# Altium schematic sheet PowerBreakout.SchDoc
size 482 x 266 mm
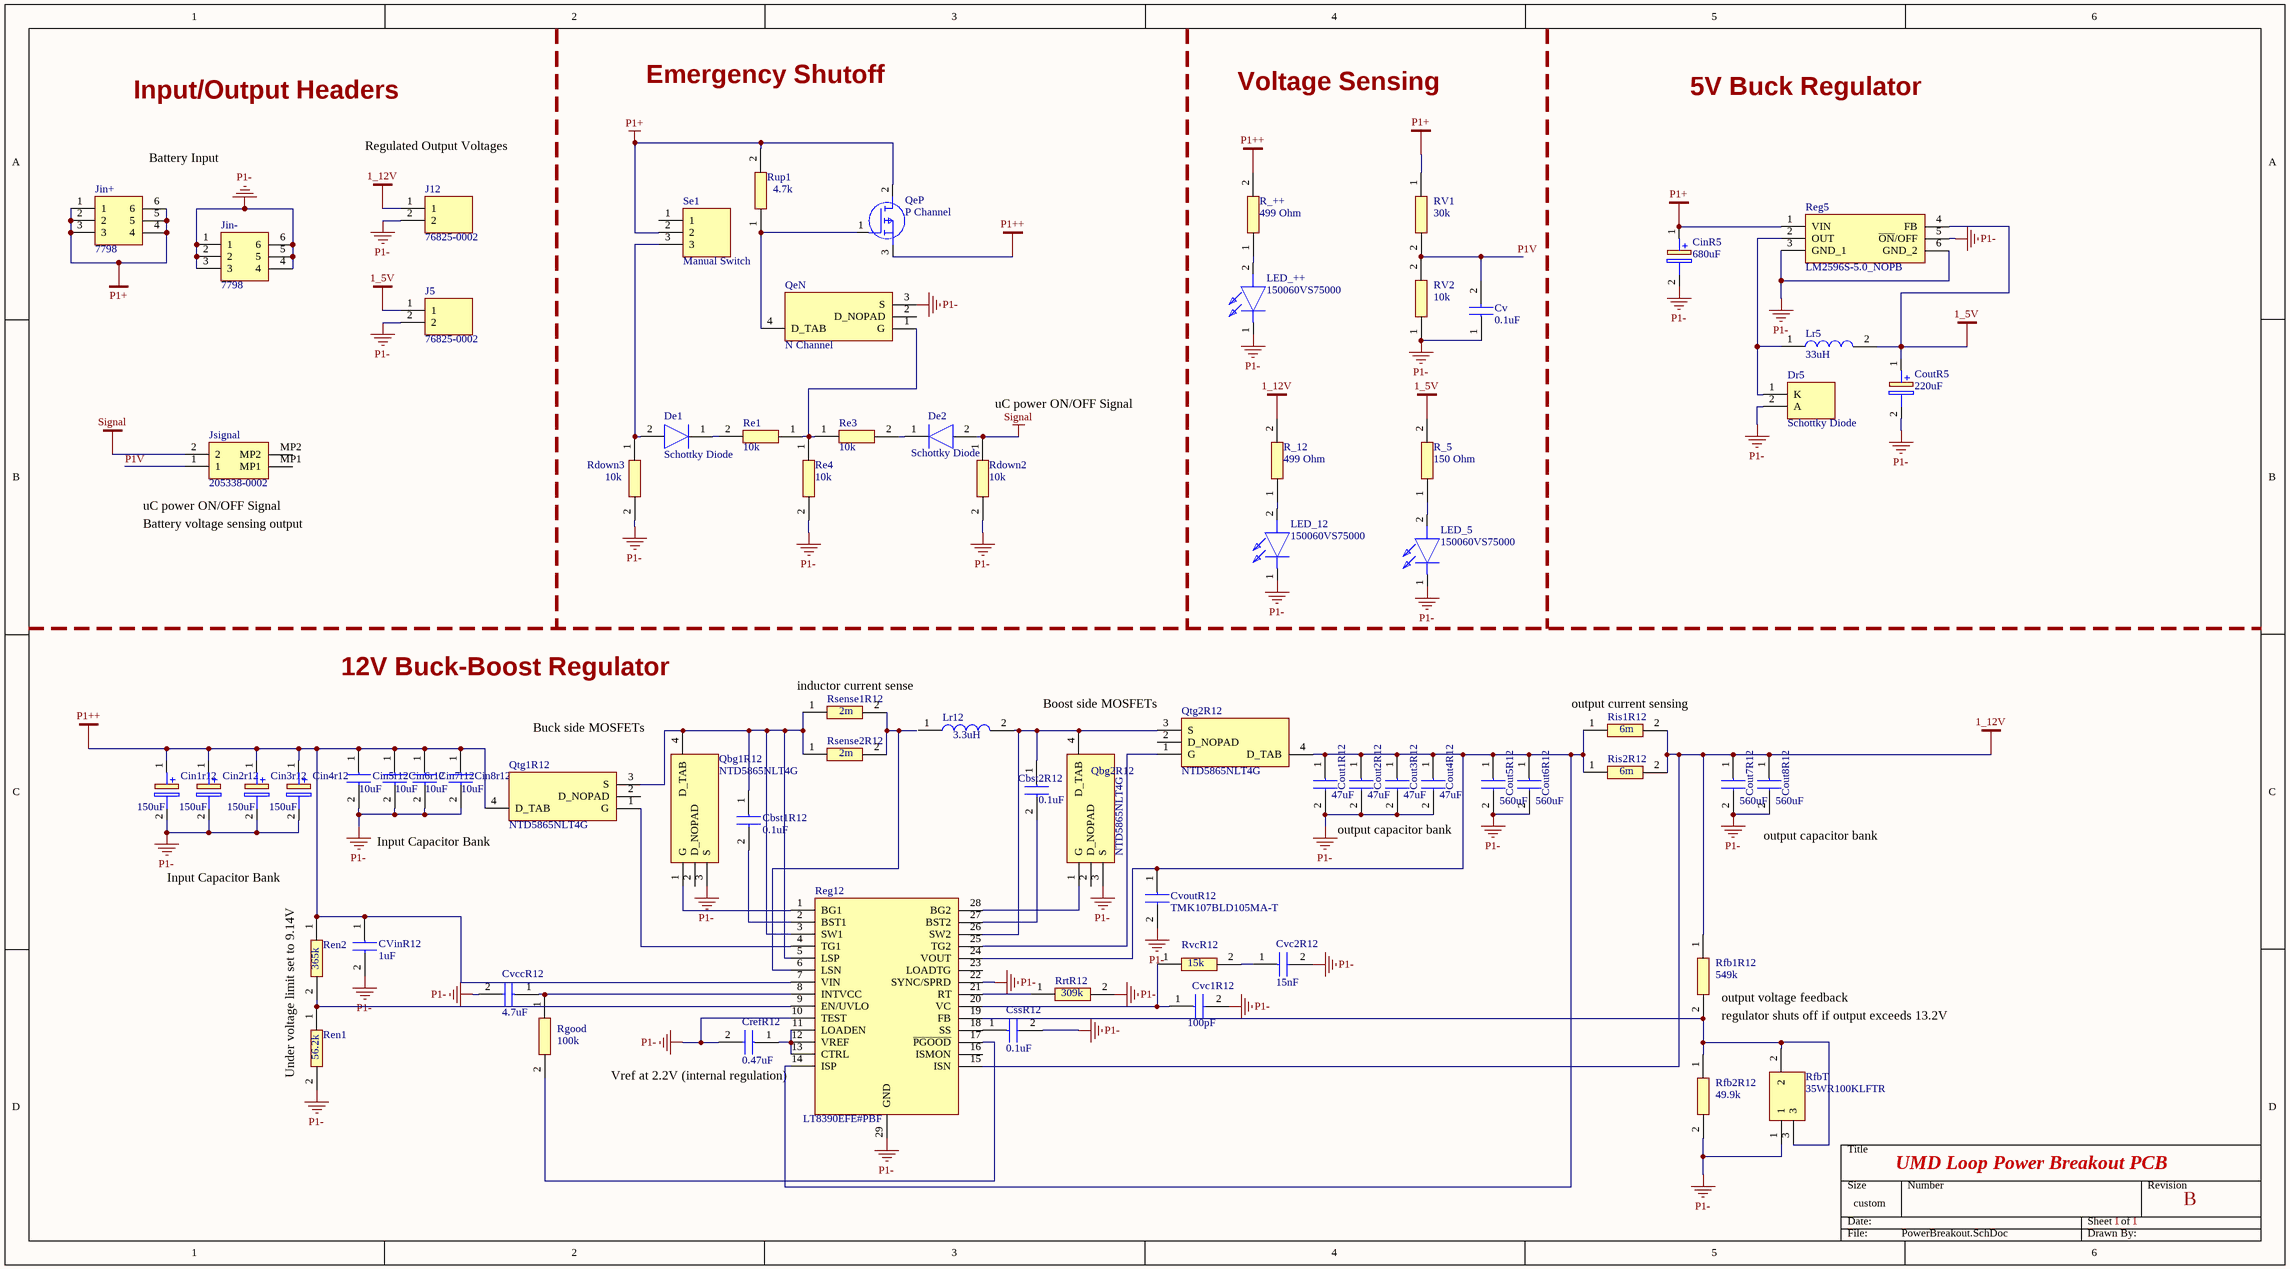
[diagram p0: PowerBreakout.SchDoc]

## Parts
Cbst1R12  0.1uF  [CAPC1608X90N]
Cbst2R12  0.1uF  [CAPC1608X90N]
Cin1r12  150uF  [CAPAE1030X1650N]
Cin2r12  150uF  [CAPAE1030X1650N]
Cin3r12  150uF  [CAPAE1030X1650N]
Cin4r12  150uF  [CAPAE1030X1650N]
Cin5r12  10uF  [CAPC3225X280N]
Cin6r12  10uF  [CAPC3225X280N]
Cin7r12  10uF  [CAPC3225X280N]
Cin8r12  10uF  [CAPC3225X280N]
CinR5  680uF  [CAPAE1030X1050N]
Cout1R12  47uF  [CAPC3216X180N]
Cout2R12  47uF  [CAPC3216X180N]
Cout3R12  47uF  [CAPC3216X180N]
Cout4R12  47uF  [CAPC3216X180N]
Cout5R12  560uF  [CAPAE830X1050N]
Cout6R12  560uF  [CAPAE830X1050N]
Cout7R12  560uF  [CAPAE830X1050N]
Cout8R12  560uF  [CAPAE830X1050N]
CoutR5  220uF  [CAPAE660X800N]
CrefR12  0.47uF  [CAPC2012X140N]
CssR12  0.1uF  [CAPC1608X90N]
Cv  0.1uF  [CAPC2012X100N]
Cvc1R12  100pF  [CAPC2012X88N]
Cvc2R12  15nF  [CAPC2012X88N]
CvccR12  4.7uF  [CAPC3316X195N]
CVinR12  1uF  [CAPC1608X50N]
CvoutR12  TMK107BLD105MA-T  [CAPC1608X50N]
De1  Schottky Diode  [SODFL3517X110N]
De2  Schottky Diode  [SODFL3517X110N]
Dr5  Schottky Diode  [SODFL4725X110N]
J5  76825-0002  [768250002]
J12  76825-0002  [768250002]
Jin+  7798  [7798]
Jin-  7798  [7798]
Jsignal  205338-0002  [2053380002]
LED_5  150060VS75000  [LEDC1608X80N]
LED_12  150060VS75000  [LEDC1608X80N]
LED_++  150060VS75000  [LEDC1608X80N]
Lr5  33uH  [MSS1210333MEB]
Lr12  3.3uH  [INDPM135125X650N]
Qbg1R12  NTD5865NLT4G  [TO229P990X238-4N]
Qbg2R12  NTD5865NLT4G  [TO229P990X238-4N]
QeN  N Channel  [TO229P990X238-4N]
QeP  P Channel  [STD36P4LLF6]
Qtg1R12  NTD5865NLT4G  [TO229P990X238-4N]
Qtg2R12  NTD5865NLT4G  [TO229P990X238-4N]
R_5  150 Ohm  [RESC2012X60N]
R_12  499 Ohm  [RESC2012X60N]
R_++  499 Ohm  [RESC2012X60N]
Rdown2  10k  [RESC2012X60N]
Rdown3  10k  [RESC2012X60N]
Re1  10k  [RESC2012X60N]
Re3  10k  [RESC2012X60N]
Re4  10k  [RESC2012X60N]
Reg5  LM2596S-5.0_NOPB  [KTT0005B]
Reg12  LT8390EFE#PBF  [SOP65P640X120-29N]
Ren1  56.2k  [RESC3216X60N]
Ren2  365k  [RESC1608X55N]
Rfb1R12  549k  [RESC2012X65N]
Rfb2R12  49.9k  [RESC2113X66N]
RfbT  35WR100KLFTR  [35WR100KLFTR]
Rgood  100k  [RESC3116X65N]
Ris1R12  6m  [FUSC6432X52N]
Ris2R12  6m  [FUSC6432X52N]
RrtR12  309k  [RESC2012X70N]
Rsense1R12  2m  [RESC6432X70N]
Rsense2R12  2m  [RESC6432X70N]
Rup1  4.7k  [RESC3116X65N]
RV1  30k  [RESC2012X60N]
RV2  10k  [RESC2012X60N]
RvcR12  15k  [RESC1608X55N]
Se1  Manual Switch  [2M1SP3T1B1M2QE]

## Nets
1_5V: CoutR5.1(+) J5.1 Lr5.2 R_5.2 Reg5.4(FB)
1_12V: Cout7R12.1(+) Cout8R12.1(+) J12.1 R_12.2 Reg12.15(ISN) Rfb1R12.1 Ris1R12.2 Ris2R12.2
P1+: CinR5.1(+) Jin+.1 Jin+.2 Jin+.3 Jin+.4 Jin+.5 Jin+.6 QeP.2(D) Reg5.1(VIN) Rup1.2 RV1.1 Se1.2
P1++: Cin1r12.1(+) Cin2r12.1(+) Cin3r12.1(+) Cin4r12.1(+) Cin5r12.1 Cin6r12.1 Cin7r12.1 Cin8r12.1 CVinR12.1 QeP.3(S) Qtg1R12.4(D_TAB) R_++.2 Reg12.7(VIN) Ren2.1
P1-: Cin1r12.2(-) Cin2r12.2(-) Cin3r12.2(-) Cin4r12.2(-) Cin5r12.2 Cin6r12.2 Cin7r12.2 Cin8r12.2 CinR5.2(-) Cout1R12.2 Cout2R12.2 Cout3R12.2 Cout4R12.2 Cout5R12.2(-) Cout6R12.2(-) Cout7R12.2(-) Cout8R12.2(-) CoutR5.2(-) CrefR12.2 CssR12.2 Cv.1 Cvc1R12.2 Cvc2R12.2 CvccR12.2 CVinR12.2 CvoutR12.2 Dr5.2(A) J5.2 J12.2 Jin-.1 Jin-.2 Jin-.3 Jin-.4 Jin-.5 Jin-.6 LED_5.1(K) LED_12.1(K) LED_++.1(K) Qbg1R12.3(S) Qbg2R12.3(S) QeN.3(S) Rdown2.2 Rdown3.2 Re4.2 Reg5.3(GND_1) Reg5.5(~{ON}/OFF) Reg5.6(GND_2) Reg12.10(TEST) Reg12.22(SYNC/SPRD) Reg12.29(GND) Ren1.2 Rfb2R12.2 RfbT.1 RrtR12.2 RV2.1
Signal: De2.2(A) Jsignal.2 Rdown2.1
P1V: Cv.2 Jsignal.1 RV1.2 RV2.2
NetCbst1R12_1: Cbst1R12.1 Qbg1R12.4(D_TAB) Qtg1R12.3(S) Reg12.3(SW1) Reg12.5(LSP) Rsense1R12.1 Rsense2R12.1
NetCbst1R12_2: Cbst1R12.2 Reg12.2(BST1)
NetCbst2R12_1: Cbst2R12.1 Lr12.2 Qbg2R12.4(D_TAB) Qtg2R12.3(S) Reg12.26(SW2)
NetCbst2R12_2: Cbst2R12.2 Reg12.27(BST2)
NetCout1R12_1: Cout1R12.1 Cout2R12.1 Cout3R12.1 Cout4R12.1 Cout5R12.1(+) Cout6R12.1(+) CvoutR12.1 Qtg2R12.4(D_TAB) Reg12.14(ISP) Reg12.24(VOUT) Ris1R12.1 Ris2R12.1
NetCrefR12_1: CrefR12.1 Reg12.11(LOADEN) Reg12.12(VREF) Reg12.13(CTRL)
NetCssR12_1: CssR12.1 Reg12.18(SS)
NetCvc1R12_1: Cvc1R12.1 Reg12.20(VC) RvcR12.1
NetCvc2R12_1: Cvc2R12.1 RvcR12.2
NetCvccR12_1: CvccR12.1 Reg12.8(INTVCC) Rgood.1
NetDe1_1: De1.1(K) Re1.2
NetDe1_2: De1.2(A) Rdown3.1 Se1.3
NetDe2_1: De2.1(K) Re3.2
NetDr5_1: Dr5.1(K) Lr5.1 Reg5.2(OUT)
NetLED_5_2: LED_5.2(A) R_5.1
NetLED_12_2: LED_12.2(A) R_12.1
NetLED_++_2: LED_++.2(A) R_++.1
NetQbg1R12_1: Qbg1R12.1(G) Reg12.1(BG1)
NetQbg2R12_1: Qbg2R12.1(G) Reg12.28(BG2)
NetQeN_1: QeN.1(G) Re1.1 Re3.1 Re4.1
NetQeN_4: QeN.4(D_TAB) QeP.1(G) Rup1.1
NetQtg1R12_1: Qtg1R12.1(G) Reg12.4(TG1)
NetQtg2R12_1: Qtg2R12.1(G) Reg12.25(TG2)
NetReg12_6: Reg12.6(LSN) Rsense1R12.2 Rsense2R12.2
NetReg12_9: Reg12.9(EN/UVLO) Ren1.1 Ren2.2
NetReg12_17: Reg12.17(~{PGOOD}) Rgood.2
NetReg12_19: Reg12.19(FB) Rfb1R12.2 Rfb2R12.1 RfbT.2 RfbT.3
NetReg12_21: Reg12.21(RT) RrtR12.1

Not connected (* = marked no-connect by the designer): Jsignal MP1 MP2; Lr12 1; Qbg1R12 2(D_NOPAD); Qbg2R12 2(D_NOPAD); QeN 2(D_NOPAD); Qtg1R12 2(D_NOPAD); Qtg2R12 2(D_NOPAD); Reg12 16(ISMON) 23(LOADTG); Se1 1

## Notes on the sheet
- Emergency Shutoff
- Input/Output Headers
- Voltage Sensing
- 5V Buck Regulator
- (near Jin+) Battery Input
- Regulated Output Voltages
- uC power ON/OFF Signal
- (near Jsignal) uC power ON/OFF Signal
- Battery voltage sensing output
- 12V Buck-Boost Regulator
- (near Rsense1R12) inductor current sense
- Buck side MOSFETs
- Boost side MOSFETs
- (near Ris1R12) output current sensing
- (near Qtg1R12) Input Capacitor Bank
- output capacitor bank
- Input Capacitor Bank
- (near Rfb1R12) output voltage feedback
- (near Rfb1R12) regulator shuts off if output exceeds 13.2V
- Under voltage limit set to 9.14V
- (near Reg12) Vref at 2.2V (internal regulation)
- UMD Loop Power Breakout PCB
- 1
- B

## Library data of the parts
Cbst1R12 Cbst2R12 CssR12 = 06033C104J4Z2A: Capacitor; Manufacturer_Name: AVX; Datasheet Link: https://componentsearchengine.com/Datasheets/1/06031A100FAT2A.pdf; Height: 0.9mm; Manufacturer_Part_Number: 06033C104J4Z2A; Mouser Part Number: 581-06033C104J4Z2A; Mouser Price/Stock: https://www.mouser.co.uk/ProductDetail/AVX/06033C104J4Z2A/?qs=%252BdQmOuGyFcHWXuPUAM5ybw%3D%3D
Cin1r12 Cin2r12 Cin3r12 Cin4r12 = EEH-ZS1J151P: Capacitor Polarised; Manufacturer_Name: Panasonic; Datasheet Link: https://industrial.panasonic.com/cdbs/www-data/pdf/RDD0000/RDD0000C1244.pdf; Height: 16.5mm; Manufacturer_Part_Number: EEH-ZS1J151P; Mouser Part Number: 667-EEH-ZS1J151P; Mouser Price/Stock: https://www.mouser.co.uk/ProductDetail/Panasonic/EEH-ZS1J151P?qs=byeeYqUIh0Ma2Xd%2FUydcug%3D%3D; Arrow Part Number: EEH-ZS1J151P; Arrow Price/Stock: https://www.arrow.com/en/products/eeh-zs1j151p/panasonic
Cin5r12 Cin6r12 Cin7r12 Cin8r12 = UMR325AC7106KM-P: Capacitor; Manufacturer_Name: TAIYO YUDEN; Datasheet Link: https://www.mouser.it/datasheet/2/396/TaiyoYuden_UMR325AC7106KM-P_SS-1888197.pdf; Height: 2.8mm; Manufacturer_Part_Number: UMR325AC7106KM-P; Mouser Part Number: 963-UMR325AC7106KM-P; Mouser Price/Stock: https://www.mouser.co.uk/ProductDetail/Taiyo-Yuden/UMR325AC7106KM-P?qs=W%2FMpXkg%252BdQ6B9FeGpdJ2Gw%3D%3D
CinR5 = EEE-FK1C681GP: Capacitor Polarised; Manufacturer_Name: Panasonic; Datasheet Link: https://www.arrow.com/en/products/eee-fk1c681gp/panasonic; Height: 10.5mm; Manufacturer_Part_Number: EEE-FK1C681GP; Mouser Part Number: 667-EEE-FK1C681GP; Mouser Price/Stock: https://www.mouser.com/Search/Refine.aspx?Keyword=667-EEE-FK1C681GP; Arrow Part Number: EEE-FK1C681GP; Arrow Price/Stock: https://www.arrow.com/en/products/eee-fk1c681gp/panasonic
Cout1R12 Cout2R12 Cout3R12 Cout4R12 = C3216X5R1E476M160AC: Capacitor; Manufacturer_Name: TDK; Datasheet Link: https://product.tdk.com/info/en/catalog/datasheets/mlcc_commercial_midvoltage_en.pdf; Height: 1.8mm; Manufacturer_Part_Number: C3216X5R1E476M160AC; Mouser Part Number: 810-C3216X5R1E476M; Mouser Price/Stock: https://www.mouser.co.uk/ProductDetail/TDK/C3216X5R1E476M160AC?qs=NRhsANhppD%252BqapdVvBvu4Q%3D%3D; Arrow Part Number: C3216X5R1E476M160AC; Arrow Price/Stock: https://www.arrow.com/en/products/c3216x5r1e476m160ac/tdk
Cout5R12 Cout6R12 Cout7R12 Cout8R12 = EEE-FT1E561UP: Capacitor; Manufacturer_Name: Panasonic; Datasheet Link: https://componentsearchengine.com/Datasheets/1/EEE-FT1E561UP.pdf; Height: 10.5mm; Manufacturer_Part_Number: EEE-FT1E561UP; Mouser Part Number: 667-EEE-FT1E561UP; Mouser Price/Stock: https://www.mouser.com/Search/Refine.aspx?Keyword=667-EEE-FT1E561UP; Arrow Part Number: EEE-FT1E561UP; Arrow Price/Stock: https://www.arrow.com/en/products/eee-ft1e561up/panasonic
CoutR5 = EEE-FKA221XAP: Capacitor Polarised; Manufacturer_Name: Panasonic; Datasheet Link: https://eu.mouser.com/datasheet/2/315/ABA0000C1175-947561.pdf; Height: 8mm; Manufacturer_Part_Number: EEE-FKA221XAP; Mouser Part Number: 667-EEE-FKA221XAP; Mouser Price/Stock: https://www.mouser.com/Search/Refine.aspx?Keyword=667-EEE-FKA221XAP
CrefR12 = 08053C474KAT2A: Capacitor; Manufacturer_Name: AVX; Datasheet Link: http://www.mouser.com/ds/2/40/X7RDielectric-777024.pdf; Height: 1.4mm; Manufacturer_Part_Number: 08053C474KAT2A; Mouser Part Number: 581-08053C474KAT2A; Mouser Price/Stock: https://www.mouser.co.uk/ProductDetail/AVX/08053C474KAT2A?qs=KSXCHhUSl%2FcOKBGY0p43NQ%3D%3D
Cv = C0805C101FCGACAUTO: Capacitor; Manufacturer_Name: Kemet; Datasheet Link: https://content.kemet.com/datasheets/KEM_C1091_C0G_ESD.pdf; Height: 1mm; Manufacturer_Part_Number: C0805C101FCGACAUTO; Mouser Part Number: 80-C0805C101FCGACAUT; Mouser Price/Stock: https://www.mouser.co.uk/ProductDetail/KEMET/C0805C101FCGACAUTO/?qs=OlC7AqGiEDnYvzW7uZC9yw%3D%3D
Cvc1R12 = C0805C101J5RACTU: Capacitor; Manufacturer_Name: Kemet; Datasheet Link: https://api.kemet.com/component-edge/download/datasheet/C0805C101J5RACTU.pdf; Height: 0.88mm; Manufacturer_Part_Number: C0805C101J5RACTU; Mouser Part Number: 80-C0805C101J5R; Mouser Price/Stock: https://www.mouser.co.uk/ProductDetail/KEMET/C0805C101J5RACTU?qs=1CrpdQ4AkN%2FJNeoQfmjuPQ%3D%3D; Arrow Part Number: C0805C101J5RACTU; Arrow Price/Stock: https://www.arrow.com/en/products/c0805c101j5ractu/kemet-corporation
Cvc2R12 = C0805C151JAGACTU: Capacitor; Manufacturer_Name: Kemet; Datasheet Link: https://www.mouser.ch/datasheet/2/212/KEM_C1003_C0G_SMD-1101588.pdf; Height: 0.88mm; Manufacturer_Part_Number: C0805C151JAGACTU; Mouser Part Number: 80-C0805C151JAGACTU; Mouser Price/Stock: https://www.mouser.co.uk/ProductDetail/KEMET/C0805C151JAGACTU?qs=rrS6PyfT74cmtFsCFUoXhw%3D%3D
CvccR12 = C1206X475K3RACAUTO7210: Capacitor; Manufacturer_Name: Kemet; Datasheet Link: https://www.mouser.com/datasheet/2/212/1/KEM_C1078_X7R_FT_CAP_AUTO_SMD-1103315.pdf; Height: 1.95mm; Manufacturer_Part_Number: C1206X475K3RACAUTO7210; Mouser Part Number: 80-C1206X475K3RAUTLR; Mouser Price/Stock: https://www.mouser.co.uk/ProductDetail/KEMET/C1206X475K3RACAUTO7210/?qs=ds50AKTGxA8JAgT9kv9azQ%3D%3D
CVinR12 CvoutR12 = TMK107BLD105MA-T: Capacitor; Manufacturer_Name: TAIYO YUDEN; Datasheet Link: https://mouser.componentsearchengine.com/Datasheets/1/TMK107BLD105MA-T.pdf; Height: 0.5mm; Manufacturer_Part_Number: TMK107BLD105MA-T; Mouser Part Number: 963-TMK107BLD105MA-T; Mouser Price/Stock: https://www.mouser.co.uk/ProductDetail/Taiyo-Yuden/TMK107BLD105MA-T?qs=lkMpTOwszhd9%2FVKw3feWjA%3D%3D
De1 De2 = PMEG4030ER,115: Diode; Manufacturer_Name: Nexperia; Datasheet Link: https://assets.nexperia.com/documents/data-sheet/PMEG4030ER.pdf; Height: 1.1mm; Manufacturer_Part_Number: PMEG4030ER,115; Mouser Part Number: 771-PMEG4030ER115; Mouser Price/Stock: https://www.mouser.co.uk/ProductDetail/Nexperia/PMEG4030ER115?qs=GcY6OjH1zdm%2Fc340ECNPOw%3D%3D; Arrow Part Number: PMEG4030ER,115; Arrow Price/Stock: https://www.arrow.com/en/products/pmeg4030er115/nexperia
Dr5 = PMEG4030EP,115: Diode; Manufacturer_Name: Nexperia; Datasheet Link: http://www.mouser.com/ds/2/302/PMEG4030EP-842598.pdf; Height: 1.1mm; Manufacturer_Part_Number: PMEG4030EP,115; Mouser Part Number: 771-PMEG4030EP,115; Mouser Price/Stock: https://www.mouser.com/Search/Refine.aspx?Keyword=771-PMEG4030EP%2C115; RS Part Number: 7816786P; RS Price/Stock: http://uk.rs-online.com/web/p/products/7816786P
J5 J12 = 76825-0002: Connector; Manufacturer_Name: Molex; Datasheet Link: https://www.molex.com/pdm_docs/sd/768250002_sd.pdf; Height: 14mm; Manufacturer_Part_Number: 76825-0002; Mouser Part Number: 538-76825-0002; Mouser Price/Stock: https://www.mouser.co.uk/ProductDetail/Molex/76825-0002?qs=KpdAywxU011SrMvnYgR78w%3D%3D
Jin+ Jin- = 7798: Connector; Manufacturer_Name: Keystone Electronics; Datasheet Link: http://www.keyelco.com/product-pdf.cfm?p=1116; Height: 6.35mm; Manufacturer_Part_Number: 7798; Mouser Part Number: 534-7798; Mouser Price/Stock: https://www.mouser.co.uk/ProductDetail/Keystone-Electronics/7798?qs=%2F%252BPMR94VuMZQhfU8Ma0DGQ%3D%3D
Jsignal = 205338-0002: Connector; Manufacturer_Name: Molex; Datasheet Link: https://eu.mouser.com/datasheet/2/276/2053380002_PCB_HEADERS-1839579.pdf; Height: 2.8mm; Manufacturer_Part_Number: 205338-0002; Mouser Part Number: 538-205338-0002; Mouser Price/Stock: https://www.mouser.co.uk/ProductDetail/Molex/205338-0002?qs=GedFDFLaBXGw%2FZd7htQeEw%3D%3D
LED_5 LED_12 LED_++ = 150060VS75000: LED; Manufacturer_Name: Wurth Elektronik; Datasheet Link: https://componentsearchengine.com/Datasheets/2/150060VS75000.pdf; Height: 0.8mm; Manufacturer_Part_Number: 150060VS75000; Mouser Part Number: 710-150060VS75000; Mouser Price/Stock: https://www.mouser.co.uk/ProductDetail/Wurth-Elektronik/150060VS75000/?qs=LlUlMxKIyB1Q1Bi5mQ%2FKLw%3D%3D
Lr5 = MSS1210-333MEB: Inductor; Manufacturer_Name: COILCRAFT; Datasheet Link: https://www.coilcraft.com/getmedia/f1a1bc5f-bdff-42f8-9ca8-1a0fb1d5094f/MSS1210.pdf; Height: 10.2mm; Manufacturer_Part_Number: MSS1210-333MEB; Mouser Part Number: 994-MSS1210-333MEB; Mouser Price/Stock: https://www.mouser.co.uk/ProductDetail/Coilcraft/MSS1210-333MEB?qs=VJjuEbE9QBMJhExHFP9gkQ%3D%3D
Lr12 = SRP1265A-3R3M: Inductor; Manufacturer_Name: Bourns; Datasheet Link: https://www.bourns.com/data/global/pdfs/SRP1265A.pdf; Height: 6.5mm; Manufacturer_Part_Number: SRP1265A-3R3M; Mouser Part Number: 652-SRP1265A-3R3M; Mouser Price/Stock: https://www.mouser.co.uk/ProductDetail/Bourns/SRP1265A-3R3M?qs=7z%252BmIopC6%2FKn2Zz%252BiwrXSg%3D%3D; Arrow Part Number: SRP1265A-3R3M; Arrow Price/Stock: https://www.arrow.com/en/products/srp1265a-3r3m/bourns
Qbg1R12 Qbg2R12 QeN Qtg1R12 Qtg2R12 = NTD5865NLT4G: Transistor; Manufacturer_Name: ON Semiconductor; Datasheet Link: http://www.onsemi.com/pub/Collateral/NTD5865NL-D.PDF; Height: 2.38mm; Manufacturer_Part_Number: NTD5865NLT4G; Mouser Part Number: 863-NTD5865NLT4G; Mouser Price/Stock: https://www.mouser.co.uk/ProductDetail/ON-Semiconductor/NTD5865NLT4G?qs=CKZJJkUYzP4m2wg5Rm81cw%3D%3D; Arrow Part Number: NTD5865NLT4G; Arrow Price/Stock: https://www.arrow.com/en/products/ntd5865nlt4g/on-semiconductor
QeP = STD36P4LLF6: MOSFET (P-Channel); Manufacturer_Name: STMicroelectronics; Datasheet Link: https://www.st.com/resource/en/datasheet/std36p4llf6.pdf; Height: 2mm; Manufacturer_Part_Number: STD36P4LLF6; Mouser Part Number: 511-STD36P4LLF6; Mouser Price/Stock: https://www.mouser.com/Search/Refine.aspx?Keyword=511-STD36P4LLF6; Arrow Part Number: STD36P4LLF6; Arrow Price/Stock: https://www.arrow.com/en/products/std36p4llf6/stmicroelectronics
R_5 = RK73H2ATTD1500F: Resistor; Manufacturer_Name: KOA Speer; Datasheet Link: http://www.koaspeer.com/catimages/Products/RK73H/RK73H.pdf; Height: 0.6mm; Manufacturer_Part_Number: RK73H2ATTD1500F; Mouser Part Number: 660-RK73H2ATTD1500F; Mouser Price/Stock: https://www.mouser.com/Search/Refine.aspx?Keyword=660-RK73H2ATTD1500F; Arrow Part Number: RK73H2ATTD1500F; Arrow Price/Stock: https://www.arrow.com/en/products/rk73h2attd1500f/koa-speer-electronics
R_12 R_++ = RK73H2ATTD4990F: Resistor; Manufacturer_Name: KOA Speer; Datasheet Link: http://www.koaspeer.com/catimages/Products/RK73H/RK73H.pdf; Height: 0.6mm; Manufacturer_Part_Number: RK73H2ATTD4990F
Rdown2 Rdown3 Re1 Re3 Re4 RV2 = CHP0805-FX-1002ELF: Resistor; Manufacturer_Name: Bourns; Datasheet Link: https://ms.componentsearchengine.com/Datasheets/1/CHP0805-FX-1002ELF.pdf; Height: 0.6mm; Manufacturer_Part_Number: CHP0805-FX-1002ELF; Mouser Part Number: 652-CHP0805FX1002ELF; Mouser Price/Stock: https://www.mouser.co.uk/ProductDetail/Bourns/CHP0805-FX-1002ELF/?qs=lc2O%252BfHJPVaDI6gsPdDtfw%3D%3D
Reg5 = LM2596S-5.0_NOPB: Integrated Circuit; Manufacturer_Name: Texas Instruments; Manufacturer_Part_Number: LM2596S-5.0/NOPB; Datasheet Link: https://www.ti.com/lit/gpn/LM2596; Mouser Part Number: 926-LM2596S-5.0/NOPB; Mouser Price/Stock: https://www.mouser.co.uk/ProductDetail/Texas-Instruments/LM2596S-50-NOPB?qs=X1J7HmVL2ZHVjCOmW%252BYINA%3D%3D; Arrow Part Number: LM2596S-5.0/NOPB; Arrow Price/Stock: https://www.arrow.com/en/products/lm2596s-5.0nopb/texas-instruments
Reg12 = LT8390EFE#PBF: Integrated Circuit; Manufacturer_Name: Linear Technology; Datasheet Link: https://www.analog.com/media/en/technical-documentation/data-sheets/8390fa.pdf; Height: 1.2mm; Manufacturer_Part_Number: LT8390EFE#PBF; Mouser Part Number: 584-LT8390EFE#PBF; Mouser Price/Stock: https://www.mouser.co.uk/ProductDetail/Analog-Devices-Linear-Technology/LT8390EFEPBF?qs=oahfZPh6IAKOx737%252BFH9lw%3D%3D; Arrow Part Number: LT8390EFE#PBF; Arrow Price/Stock: https://www.arrow.com/en/products/lt8390efepbf/linear-technology
Ren1 = CRCW120656K2FKEA: Resistor; Manufacturer_Name: Vishay; Datasheet Link: http://www.vishay.com/docs/20035/dcrcwe3.pdf; Height: 0.6mm; Manufacturer_Part_Number: CRCW120656K2FKEA; Mouser Part Number: 71-CRCW1206-56.2K-E3; Mouser Price/Stock: https://www.mouser.co.uk/ProductDetail/Vishay-Dale/CRCW120656K2FKEA?qs=4im3x1c%252BplzUgmceNd2xig%3D%3D; Arrow Part Number: CRCW120656K2FKEA; Arrow Price/Stock: https://www.arrow.com/en/products/crcw120656k2fkea/vishay
Ren2 = CR0603-FX-3653ELF: Resistor; Manufacturer_Name: Bourns; Datasheet Link: https://www.bourns.com/pdfs/chpreztr.pdf; Height: 0.55mm; Manufacturer_Part_Number: CR0603-FX-3653ELF; Mouser Part Number: 652-CR0603FX-3653ELF; Mouser Price/Stock: https://www.mouser.com/Search/Refine.aspx?Keyword=652-CR0603FX-3653ELF
Rfb1R12 = RP73D2A1M0BTDF: Resistor; Manufacturer_Name: TE Connectivity; Datasheet Link: https://www.mouser.com/datasheet/2/418/NG_DS_1773272_L-733409.pdf; Height: 0.65mm; Manufacturer_Part_Number: RP73D2A1M0BTDF; Mouser Part Number: 279-RP73D2A1M0BTDF; Mouser Price/Stock: https://www.mouser.com/Search/Refine.aspx?Keyword=279-RP73D2A1M0BTDF; Arrow Part Number: RP73D2A1M0BTDF; Arrow Price/Stock: https://www.arrow.com/en/products/rp73d2a1m0btdf/te-connectivity
Rfb2R12 = PFC-W0805LF-03-1073-B: Resistor; Manufacturer_Name: IRC / TT Electronics; Datasheet Link: http://www.ttelectronicsresistors.com/datasheets/pfc.pdf; Height: 0.66mm; Manufacturer_Part_Number: PFC-W0805LF-03-1073-B; Mouser Part Number: 66-PFC08LF107K-B; Mouser Price/Stock: https://www.mouser.com/Search/Refine.aspx?Keyword=66-PFC08LF107K-B; Arrow Part Number: PFC-W0805LF-03-1073-B; Arrow Price/Stock: https://www.arrow.com/en/products/pfc-w0805lf-03-1073-b/irc
RfbT = 35WR100KLFTR: Variable Resistor; Manufacturer_Name: BI Technologies; Datasheet Link: http://www.ttelectronics.com/sites/default/files/download-files/Datasheet_MultiTurn%20Trimmer_35.pdf; Height: 1.8mm; Manufacturer_Part_Number: 35WR100KLFTR; Mouser Part Number: 858-35WR100KLFTR; Mouser Price/Stock: https://www.mouser.co.uk/ProductDetail/BI-Technologies-TT-Electronics/35WR100KLFTR?qs=K%2Fj%2Fqf%252B0fqIOPAX2997AbQ%3D%3D
Rgood = CMP1206AFX-5601ELF: Resistor; Manufacturer_Name: Bourns; Datasheet Link: http://www.bourns.com/docs/Product-Datasheets/CMP-A.pdf; Height: 0.65mm; Manufacturer_Part_Number: CMP1206AFX-5601ELF; Mouser Part Number: 652-CMP1206AFX-5601L; Mouser Price/Stock: https://www.mouser.co.uk/ProductDetail/Bourns/CMP1206AFX-5601ELF/?qs=TiOZkKH1s2RUs9dCUW7AmQ%3D%3D
Ris1R12 Ris2R12 = PMR100HZPFU6L00: Resistor; Manufacturer_Name: ROHM Semiconductor; Datasheet Link: https://componentsearchengine.com/Datasheets/2/PMR100HZPFU6L00.pdf; Height: 0.52mm; Manufacturer_Part_Number: PMR100HZPFU6L00; Mouser Part Number: 755-PMR100HZPFU6L00; Mouser Price/Stock: https://www.mouser.co.uk/ProductDetail/ROHM-Semiconductor/PMR100HZPFU6L00?qs=oBjDkOCjPF171GUXMPOJKw%3D%3D
RrtR12 = ERJ-6ENF3093V: Resistor; Manufacturer_Name: Panasonic; Datasheet Link: https://industrial.panasonic.com/cdbs/www-data/pdf/RDA0000/AOA0000C84.pdf; Height: 0.7mm; Manufacturer_Part_Number: ERJ-6ENF3093V; Mouser Part Number: 667-ERJ-6ENF3093V; Mouser Price/Stock: https://www.mouser.com/Search/Refine.aspx?Keyword=667-ERJ-6ENF3093V; Arrow Part Number: ERJ-6ENF3093V; Arrow Price/Stock: https://www.arrow.com/en/products/erj-6enf3093v/panasonic
Rsense1R12 Rsense2R12 = ULRB22512R002FLFSLT: Resistor; Manufacturer_Name: IRC / TT Electronics; Datasheet Link: https://www.mouser.tw/datasheet/2/414/ULR-1528281.pdf; Height: 0.7mm; Manufacturer_Part_Number: ULRB22512R002FLFSLT; Mouser Part Number: 66-ULRB2R002FLFSLT; Mouser Price/Stock: https://www.mouser.co.uk/ProductDetail/IRC-TT-Electronics/ULRB22512R002FLFSLT?qs=s5trV0%2FfZq%252BR4bsgICwL%252Bw%3D%3D
Rup1 = CHP1206AFX-4701ELF: Resistor; Manufacturer_Name: Bourns; Datasheet Link: https://www.mouser.be/datasheet/2/54/chp-a-1858677.pdf; Height: 0.65mm; Manufacturer_Part_Number: CHP1206AFX-4701ELF; Mouser Part Number: 652-CHP1206AFX-4701L; Mouser Price/Stock: https://www.mouser.co.uk/ProductDetail/Bourns/CHP1206AFX-4701ELF/?qs=GedFDFLaBXHtzjpWW2eupA%3D%3D
RV1 = CRCW080530K0FKEAC: Resistor; Manufacturer_Name: Vishay; Datasheet Link: https://mouser.componentsearchengine.com/Datasheets/1/CRCW080530K0FKEAC.pdf; Height: 0.6mm; Manufacturer_Part_Number: CRCW080530K0FKEAC; Mouser Part Number: 71-CRCW080530K0FKEAC; Mouser Price/Stock: https://www.mouser.com/Search/Refine.aspx?Keyword=71-CRCW080530K0FKEAC; Arrow Part Number: CRCW080530K0FKEAC; Arrow Price/Stock: https://www.arrow.com/en/products/crcw080530k0fkeac/vishay
RvcR12 = ERA-3VEB1502V: Resistor; Manufacturer_Name: Panasonic; Datasheet Link: https://www.mouser.in/datasheet/2/315/Panasonic_Resistor_Thin_Film_(ERA-xV_2c_ERA-xK_Ser-1815278.pdf; Height: 0.55mm; Manufacturer_Part_Number: ERA-3VEB1502V; Mouser Part Number: 667-ERA-3VEB1502V; Mouser Price/Stock: https://www.mouser.co.uk/ProductDetail/Panasonic/ERA-3VEB1502V?qs=OlC7AqGiEDkoKxA%252BvKCzUw%3D%3D
Se1 = 2M1-SP1-T1-B1-M2QE: Switch; Manufacturer_Name: Carling Technologies; Datasheet Link: https://www.carlingtech.com/sites/default/files/documents/Carling-MTS-2M-Series.pdf; Height: 28.2mm; Manufacturer_Part_Number: 2M1-SP1-T1-B1-M2QE; Mouser Part Number: 691-2M1-SP1-T1B1M2QE; Mouser Price/Stock: https://www.mouser.com/Search/Refine.aspx?Keyword=691-2M1-SP1-T1B1M2QE; RS Part Number: 8798332; RS Price/Stock: http://uk.rs-online.com/web/p/products/8798332